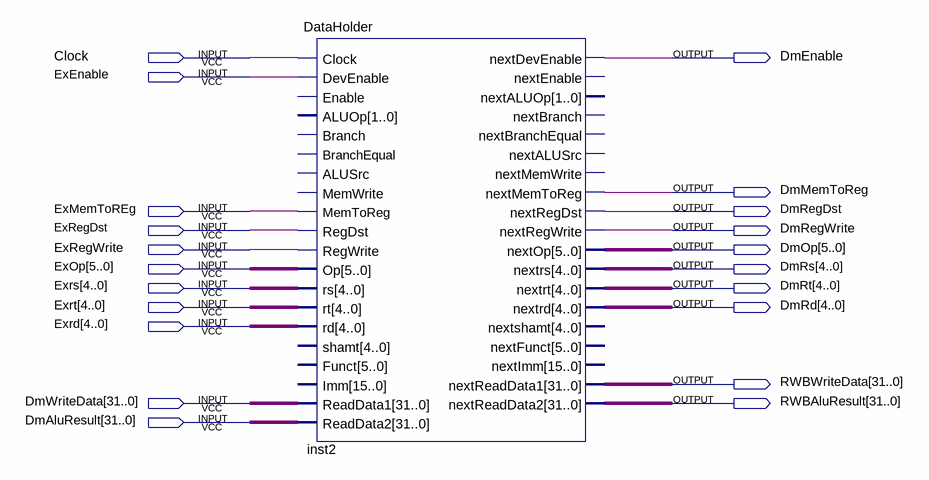
[diagram p0: schematic sheet]
// Quartus schematic Dm.bdf as structural Verilog: 1 symbols, 21 pins
module Dm (
  input  Clock,
  input  ExEnable,
  input  ExMemToREg,
  input  ExRegDst,
  input  ExRegWrite,
  input  [5:0] ExOp,
  input  [4:0] Exrs,
  input  [4:0] Exrt,
  input  [4:0] Exrd,
  input  [31:0] DmWriteData,
  input  [31:0] DmAluResult,
  output DmEnable,
  output DmMemToReg,
  output DmRegDst,
  output DmRegWrite,
  output [5:0] DmOp,
  output [4:0] DmRs,
  output [4:0] DmRt,
  output [4:0] DmRd,
  output [31:0] RWBWriteData,
  output [31:0] RWBAluResult
);

  DataHolder inst2 (
    .Clock(Clock), .DevEnable(ExEnable), .MemToReg(ExMemToREg), .RegDst(ExRegDst), .RegWrite(ExRegWrite),
    .Op(ExOp), .rs(Exrs), .rt(Exrt), .rd(Exrd), .ReadData1(DmWriteData), .ReadData2(DmAluResult),
    .nextDevEnable(DmEnable), .nextMemToReg(DmMemToReg), .nextRegDst(DmRegDst), .nextRegWrite(DmRegWrite),
    .nextOp(DmOp), .nextrs(DmRs), .nextrt(DmRt), .nextrd(DmRd), .nextReadData1(RWBWriteData),
    .nextReadData2(RWBAluResult));  // open: Enable, ALUOp, Branch, BranchEqual, ALUSrc, MemWrite, shamt, Funct, Imm, nextEnable, nextALUOp, nextBranch, nextBranchEqual, nextALUSrc, nextMemWrite, nextshamt, nextFunct, nextImm
endmodule
